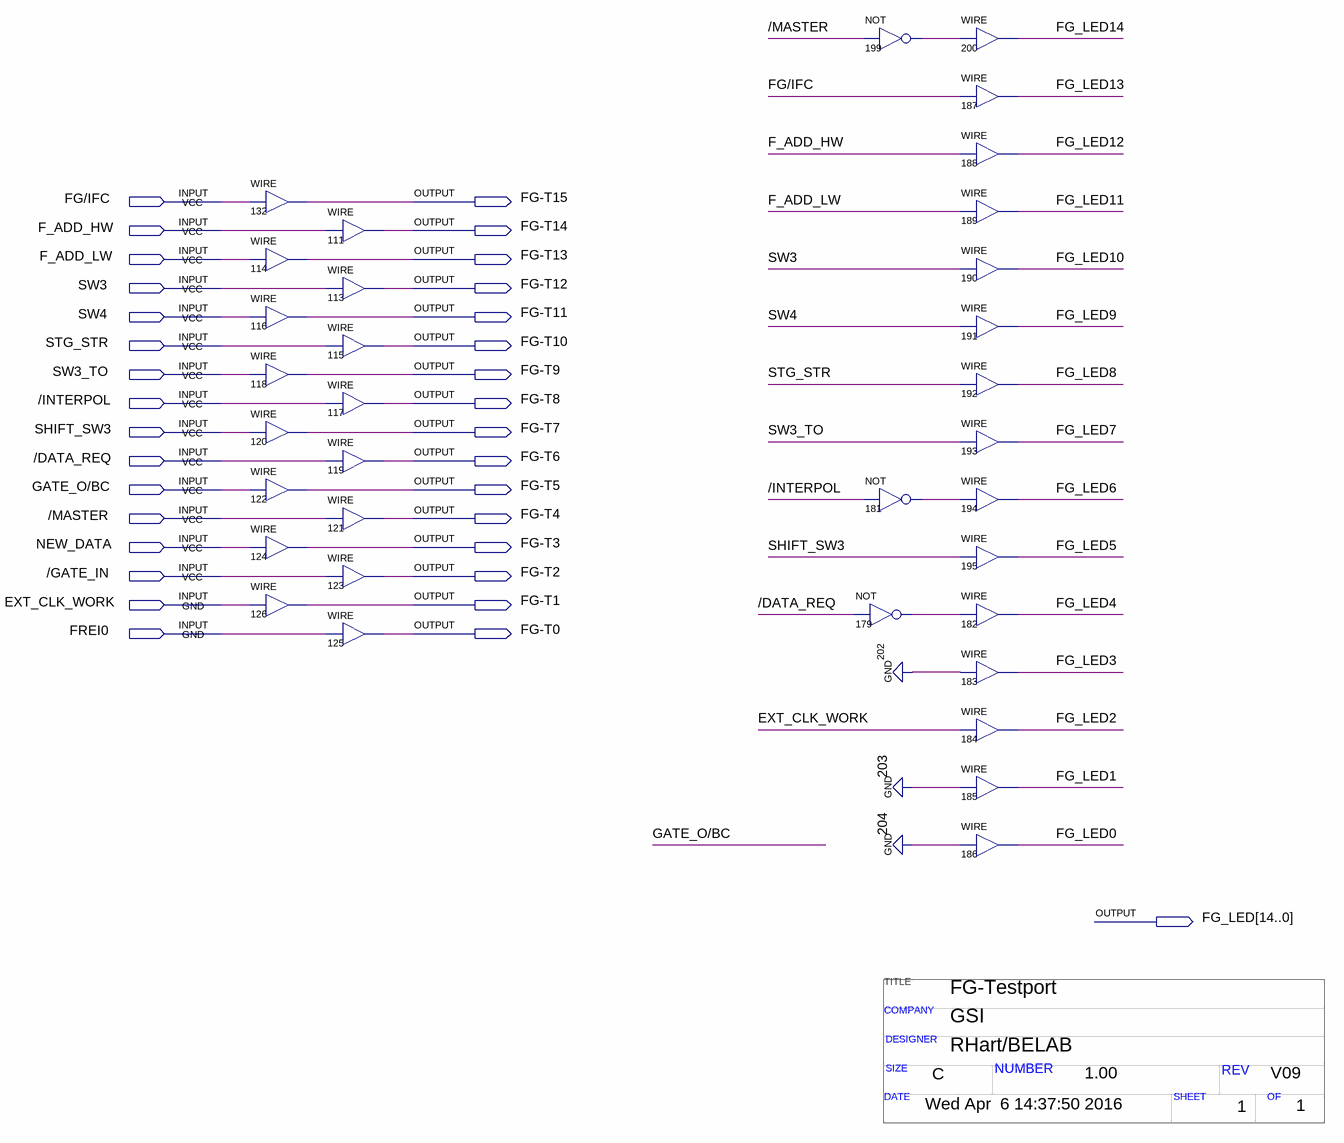
[diagram p0: schematic sheet]
// Quartus schematic fg-testport.bdf as structural Verilog: 34 symbols, 33 pins
// Title block: TITLE: FG-Testport; COMPANY: GSI; DESIGNER: RHart/BELAB; SIZE: C; NUMBER: 1.00; REV: V09; DATE: Wed Apr  6 14:37:50 2016; SHEET: 1; OF: 1
module \fg-testport  (
  input  \FG/IFC ,
  input  F_ADD_HW,
  input  F_ADD_LW,
  input  SW3,
  input  SW4,
  input  STG_STR,
  input  SW3_TO,
  input  \/INTERPOL ,
  input  SHIFT_SW3,
  input  \/DATA_REQ ,
  input  \GATE_O/BC ,
  input  \/MASTER ,
  input  NEW_DATA,
  input  \/GATE_IN ,
  input  EXT_CLK_WORK,
  input  FREI0,
  output \FG-T15 ,
  output \FG-T14 ,
  output \FG-T13 ,
  output \FG-T12 ,
  output \FG-T11 ,
  output \FG-T10 ,
  output \FG-T9 ,
  output \FG-T8 ,
  output \FG-T7 ,
  output \FG-T6 ,
  output \FG-T5 ,
  output \FG-T4 ,
  output \FG-T3 ,
  output \FG-T2 ,
  output \FG-T1 ,
  output \FG-T0 ,
  output [14:0] FG_LED
);

  wire n179_out, n181_out, n199_out;

  assign \FG-T15  = \FG/IFC ;  // WIRE 132
  assign \FG-T13  = F_ADD_LW;  // WIRE 114
  assign \FG-T11  = SW4;  // WIRE 116
  assign \FG-T9  = SW3_TO;  // WIRE 118
  assign \FG-T7  = SHIFT_SW3;  // WIRE 120
  assign \FG-T5  = \GATE_O/BC ;  // WIRE 122
  assign \FG-T3  = NEW_DATA;  // WIRE 124
  assign \FG-T1  = EXT_CLK_WORK;  // WIRE 126
  assign \FG-T14  = F_ADD_HW;  // WIRE 111
  assign \FG-T12  = SW3;  // WIRE 113
  assign \FG-T10  = STG_STR;  // WIRE 115
  assign \FG-T8  = \/INTERPOL ;  // WIRE 117
  assign \FG-T6  = \/DATA_REQ ;  // WIRE 119
  assign \FG-T4  = \/MASTER ;  // WIRE 121
  assign \FG-T2  = \/GATE_IN ;  // WIRE 123
  assign \FG-T0  = FREI0;  // WIRE 125
  not u_179 (n179_out, \/DATA_REQ );
  not u_199 (n199_out, \/MASTER );
  not u_181 (n181_out, \/INTERPOL );
  assign FG_LED[14] = n199_out;  // WIRE 200
  assign FG_LED[13] = \FG/IFC ;  // WIRE 187
  assign FG_LED[12] = F_ADD_HW;  // WIRE 188
  assign FG_LED[11] = F_ADD_LW;  // WIRE 189
  assign FG_LED[10] = SW3;  // WIRE 190
  assign FG_LED[9] = SW4;  // WIRE 191
  assign FG_LED[8] = STG_STR;  // WIRE 192
  assign FG_LED[7] = SW3_TO;  // WIRE 193
  assign FG_LED[6] = n181_out;  // WIRE 194
  assign FG_LED[5] = SHIFT_SW3;  // WIRE 195
  assign FG_LED[4] = n179_out;  // WIRE 182
  assign FG_LED[3] = 1'b0;  // WIRE 183
  assign FG_LED[2] = EXT_CLK_WORK;  // WIRE 184
  assign FG_LED[1] = 1'b0;  // WIRE 185
  assign FG_LED[0] = 1'b0;  // WIRE 186
endmodule
